# Altium schematic sheet [1]_Power_Supply.SchDoc
size A4
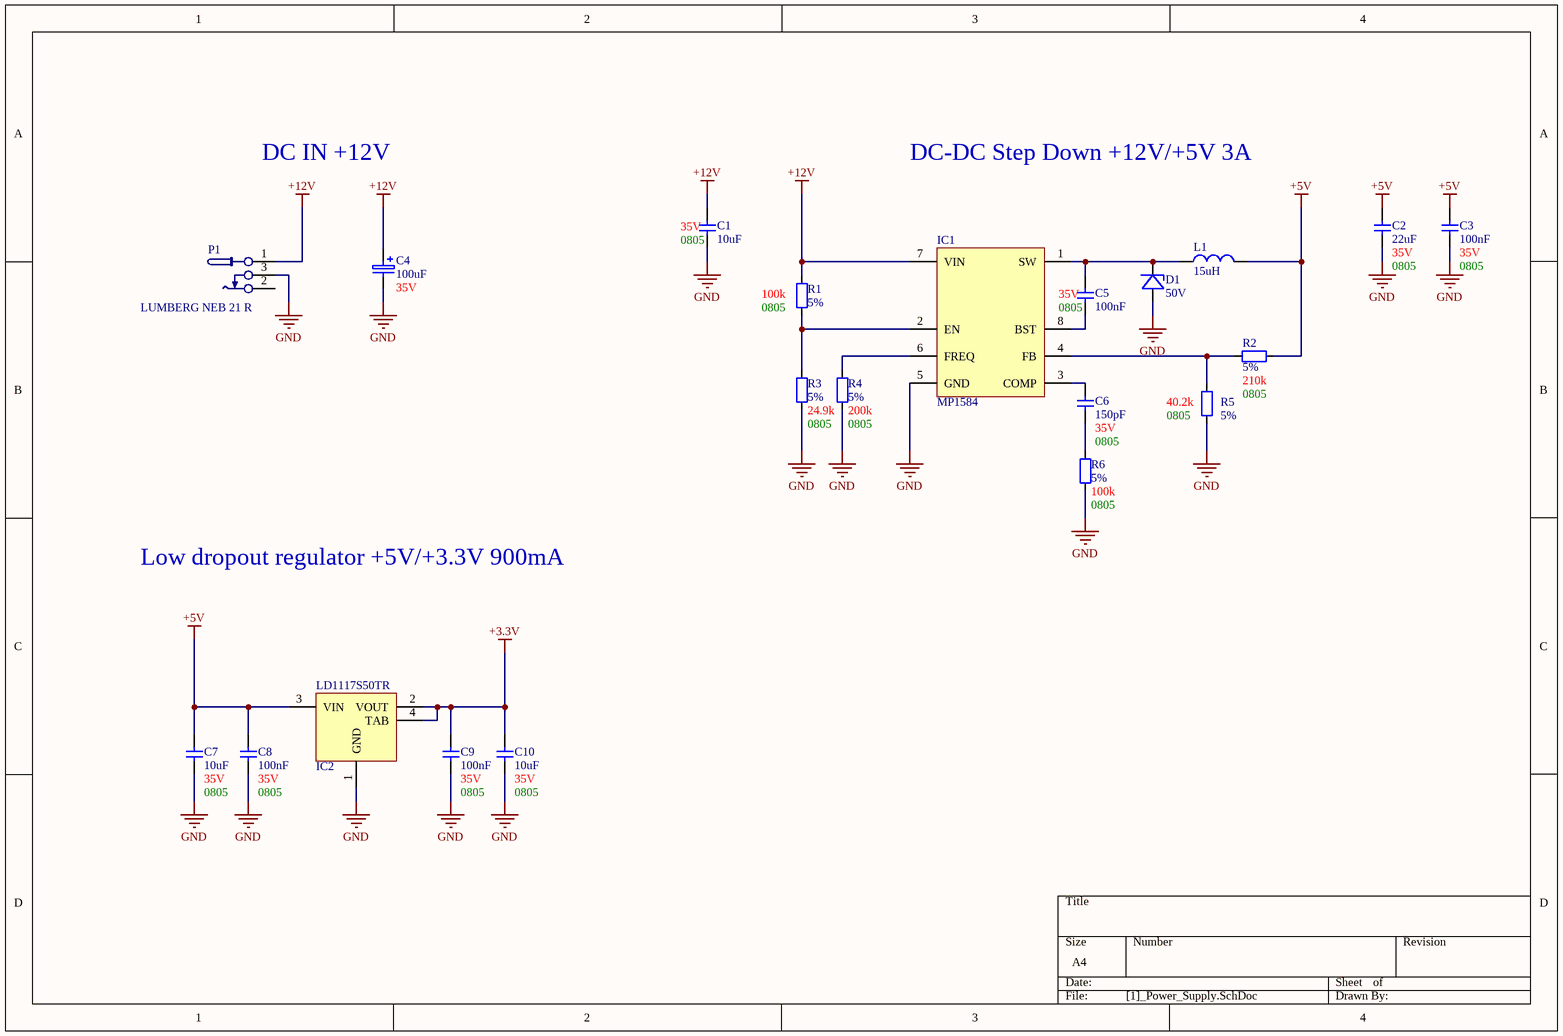
[diagram p0: [1]_Power_Supply.SchDoc]

## Parts
C1  value 10uF  Voltage: 35V  Package: 0805  [Capacitor_0805]  (hidden comment: Capacitor SMD 0805)
C2  value 22uF  Voltage: 35V  Package: 0805  [Capacitor_0805]  (hidden comment: Capacitor SMD 0805)
C3  value 100nF  Voltage: 35V  Package: 0805  [Capacitor_0805]  (hidden comment: Capacitor SMD 0805)
C4  value 100uF  Voltage: 35V  [CAP_EL5x5.4mm]  (hidden comment: Polarized capacitor SMD  5x5.4mm)
C5  value 100nF  Voltage: 35V  Package: 0805  [Capacitor_0805]  (hidden comment: Capacitor SMD 0805)
C6  value 150pF  Voltage: 35V  Package: 0805  [Capacitor_0805]  (hidden comment: Capacitor SMD 0805)
C7  value 10uF  Voltage: 35V  Package: 0805  [Capacitor_0805]  (hidden comment: Capacitor SMD 0805)
C8  value 100nF  Voltage: 35V  Package: 0805  [Capacitor_0805]  (hidden comment: Capacitor SMD 0805)
C9  value 100nF  Voltage: 35V  Package: 0805  [Capacitor_0805]  (hidden comment: Capacitor SMD 0805)
C10  value 10uF  Voltage: 35V  Package: 0805  [Capacitor_0805]  (hidden comment: Capacitor SMD 0805)
D1  50V  [DO214-AA]
IC1  MP1584  [SOP8E]
IC2  LD1117S50TR  [SOT-223]
L1  15uH  [SDR0604-150YL]
P1  LUMBERG NEB 21 R  [LUMBERG_NEB_21R]
R1  Tolerance: 5%  Package: 0805  [R_0805]  (hidden comment: 100k)
R2  Tolerance: 5%  Package: 0805  [R_0805]  (hidden comment: 210k)
R3  Tolerance: 5%  Package: 0805  [R_0805]  (hidden comment: 24.9k)
R4  Tolerance: 5%  Package: 0805  [R_0805]  (hidden comment: 200k)
R5  Tolerance: 5%  Package: 0805  [R_0805]  (hidden comment: 40.2k)
R6  Tolerance: 5%  Package: 0805  [R_0805]  (hidden comment: 100k)

## Nets
+3.3V: C9.2 C10.1 IC2.2(VOUT) IC2.4(TAB)
+5V: C2.2 C3.2 C7.2 C8.1 IC2.3(VIN) L1.2 R2.2
+12V: C1.2 C4.1 IC1.7(VIN) P1.1 R1.2
GND: C1.1 C2.1 C3.1 C4.2 C7.1 C8.2 C9.1 C10.2 D1.A IC1.5(GND) IC1.9(THERM) IC2.1(GND) P1.3 R3.1 R4.1 R5.1 R6.1
NetC5_1: C5.1 IC1.8(BST)
NetC5_2: C5.2 D1.C IC1.1(SW) L1.1
NetC6_1: C6.1 R6.2
NetC6_2: C6.2 IC1.3(COMP)
NetIC1_2: IC1.2(EN) R1.1 R3.2
NetIC1_4: IC1.4(FB) R2.1 R5.2
NetIC1_6: IC1.6(FREQ) R4.2

Not connected (* = marked no-connect by the designer): P1 2

## Notes on the sheet
- Labels drawn without touching a wire or pin: DC IN +12V, DC-DC Step Down +12V/+5V 3A, Low dropout regulator +5V/+3.3V 900mA

## Library data of the parts
C1-C3 C5-C10 = Capacitor SMD 0805: Ceramic Capacitor SMD 0805; Tolerance: 10%
C4 = Polarized capacitor SMD  5x5.4mm: Electrolytic Capacitor SMD 5x5.4mm
D1 = Diode Rectifier RS3AB-13-F: RS3AB-13-F -Diode Standard 50V 3A Surface Mount SMB; MaxCurrent: Current
IC1 = MP1584: MP1584_3A, 1.5MHz, 28V_Step-Down Converter
IC2 = LD1117S50TR: LD1117S50TR - Fixed low drop positive voltage regulator
L1 = SDR0604-150YL: SDR0604-150YL - SMD Power Inductors
P1 = LUMBERG NEB 21 R: LUMBERG NEB 21 R DC Power Connector
R1-R6 = Resistor SMD 0805
  R1 R6: Value: 100k
  R2: Value: 210k
  R3: Value: 24.9k
  R4: Value: 200k
  R5: Value: 40.2k